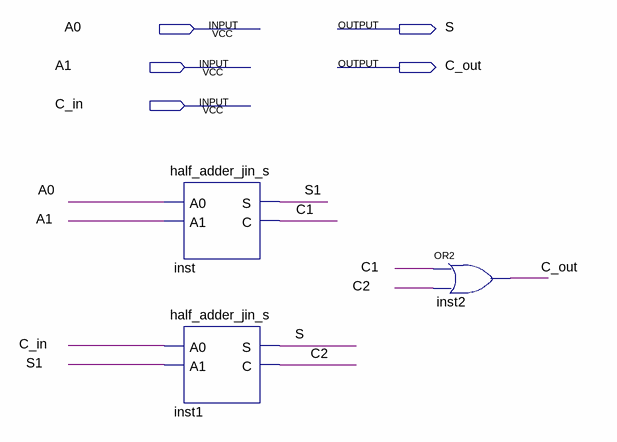
[diagram p0: schematic sheet]
// Quartus schematic full_adder_jin_s.bdf as structural Verilog: 3 symbols, 5 pins
module full_adder_jin_s (
  input  A0,
  input  A1,
  input  C_in,
  output S,
  output C_out
);

  wire C1, C2, S1;

  half_adder_jin_s inst (.A0(A0), .A1(A1), .S(S1), .C(C1));
  half_adder_jin_s inst1 (.A0(C_in), .A1(S1), .S(S), .C(C2));
  or inst2 (C_out, C1, C2);
endmodule
